# EAGLE design dice (EAGLE 5.07)
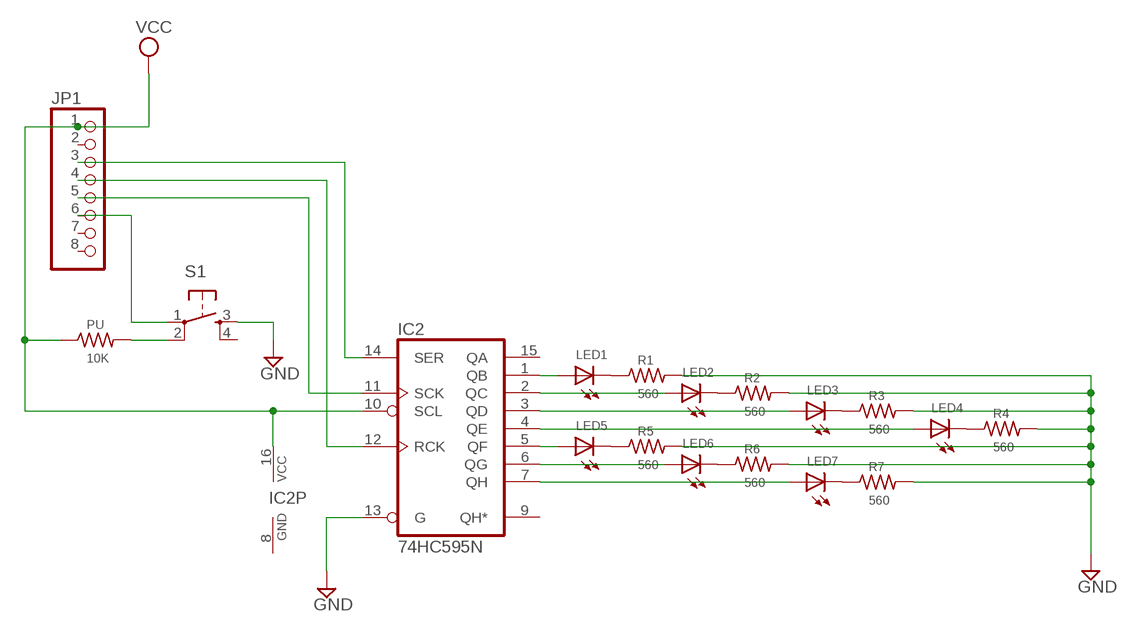
[diagram p0: schematic, sheet 1]

## Parts
IC2  74HC595N  [DIL16]
JP1  PINHD-1X8  [1X08]
LED1  LEDLUMILED  LED5MM  [LED5MM]
LED2  LEDLUMILED  LED5MM  [LED5MM]
LED3  LEDLUMILED  LED5MM  [LED5MM]
LED4  LEDLUMILED  LED5MM  [LED5MM]
LED5  LEDLUMILED  LED5MM  [LED5MM]
LED6  LEDLUMILED  LED5MM  [LED5MM]
LED7  LEDLUMILED  LED5MM  [LED5MM]
PU  10K  R-US_0204/5  [0204/5]
R1  560  R-US_0204/5  [0204/5]
R2  560  R-US_0204/5  [0204/5]
R3  560  R-US_0204/5  [0204/5]
R4  560  R-US_0204/5  [0204/5]
R5  560  R-US_0204/5  [0204/5]
R6  560  R-US_0204/5  [0204/5]
R7  560  R-US_0204/5  [0204/5]
S1  TAC_SWITCHPTH  [TACTILE-PTH]

## Nets
GND: IC2.13(G) R1.2 R2.2 R3.2 R4.2 R5.2 R6.2 R7.2 S1.3
LED1: IC2.1(QB) LED1.A
N$1: LED1.K(C) R1.1
N$2: IC2.14(SER) JP1.3
N$3: IC2.2(QC) LED2.A
N$4: IC2.3(QD) LED3.A
N$5: IC2.4(QE) LED4.A
N$6: IC2.5(QF) LED5.A
N$7: IC2.6(QG) LED6.A
N$8: IC2.7(QH) LED7.A
N$9: LED2.K(C) R2.1
N$10: LED3.K(C) R3.1
N$11: LED4.K(C) R4.1
N$12: LED5.K(C) R5.1
N$13: LED6.K(C) R6.1
N$14: LED7.K(C) R7.1
N$15: IC2.12(RCK) JP1.4
N$16: IC2.11(SCK) JP1.5
N$17: JP1.6 S1.1
N$18: PU.2 S1.2
VCC: IC2.10(SCL) IC2.16(VCC) JP1.1 PU.1
Unconnected: IC2.9(QH*) IC2.15(QA) JP1.2 JP1.7 JP1.8 S1.4

## Power pins joined to a net without a drawn wire
GND: IC2.8(GND)

## Library data of the parts
IC2 = 74xx-eu:74*595: 8-bit SHIFT REGISTER, output latch
JP1 = pinhead:PINHD-1X8: PIN HEADER
LED1-LED7 = led:LED: LED OSRAM: - CHIPLED LG R971, LG N971, LY N971, LG Q971, LY Q971, LO R971, LY R971 LH N974, LH R974 LS Q976, LO Q976, LY Q976 LO Q996 - Hyper CHIPLED LW Q18S LB Q993, LB Q99A, LB R99A - SideLED LS A670, LO A670, LY A670, LG A670, LP A670 LB A673, LV A673, LT A673, LW A673 LH A674 LY A675 LS A676, LA A676, LO A676, LY A676, LW A676 LS A679, LY A679, LG A679 - Hyper Micro SIDELED® LS Y876, LA Y876, LO Y876, LY Y876 LT Y87S - SmartLED LW L88C, LW L88S LB L89C, LB L89S, LG L890 LS L89K, LO L89K, LY L89K LS L896, LA L896, LO L896, LY L896 - TOPLED LS T670, LO T670, LY T670, LG T670, LP T670 LSG T670, LSP T670, LSY T670, LOP T670, LYG T670 LG T671, LOG T671, LSG T671 LB T673, LV T673, LT T673, LW T673 LH T674 LS T676, LA T676, LO T676, LY T676, LB T676, LH T676, LSB T676, LW T676 LB T67C, LV T67C, LT T67C, LS T67K, LO T67K, LY T67K, LW E67C LS E67B, LA E67B, LO E67B, LY E67B, LB E67C, LV E67C, LT E67C LW T67C LS T679, LY T679, LG T679 LS T770, LO T770, LY T770, LG T770, LP T770 LB T773, LV T773, LT T773, LW T773 LH T774 LS E675, LA E675, LY E675, LS T675 LS T776, LA T776, LO T776, LY T776, LB T776 LHGB T686 LT T68C, LB T68C - Hyper Mini TOPLED® LB M676 - Mini TOPLED Santana® LG M470 LS M47K, LO M47K, LY M47K Source: http://www.osram.convergy.de LUXEON: - LUMILED® LXK2-PW12-R00, LXK2-PW12-S00, LXK2-PW14-U00, LXK2-PW14-V00 LXK2-PM12-R00, LXK2-PM12-S00, LXK2-PM14-U00 LXK2-PE12-Q00, LXK2-PE12-R00, LXK2-PE12-S00, LXK2-PE14-T00, LXK2-PE14-U00 LXK2-PB12-K00, LXK2-PB12-L00, LXK2-PB12-M00, LXK2-PB14-N00, LXK2-PB14-P00, LXK2-PB14-Q00 LXK2-PR12-L00, LXK2-PR12-M00, LXK2-PR14-Q00, LXK2-PR14-R00 LXK2-PD12-Q00, LXK2-PD12-R00, LXK2-PD12-S00 LXK2-PH12-R00, LXK2-PH12-S00 LXK2-PL12-P00, LXK2-PL12-Q00, LXK2-PL12-R00 Source: www.luxeon.com KINGBRIGHT: KA-3528ASYC Source: www.kingbright.com
PU R1-R7 = resistor:R-US_: RESISTOR, American symbol
S1 = SparkFun:TAC_SWITCH: Momentary Switch Button commonly used for reset or general input. Spark Fun Electronics SKU : COM-00097

## Board
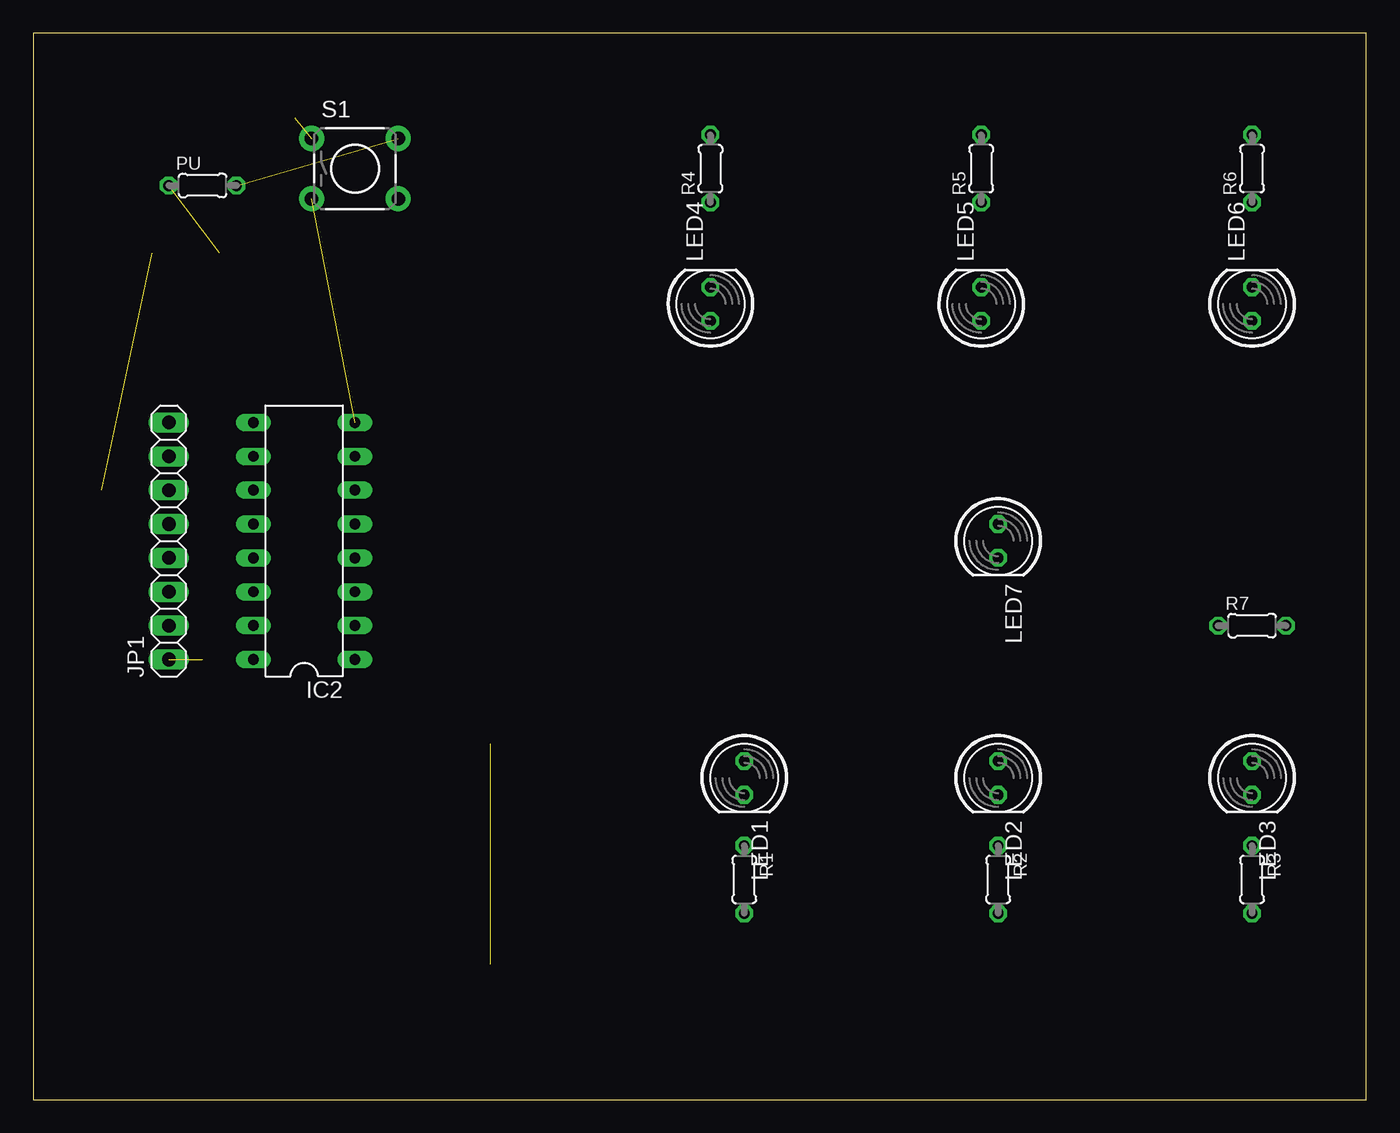
[diagram p1: board, top side]
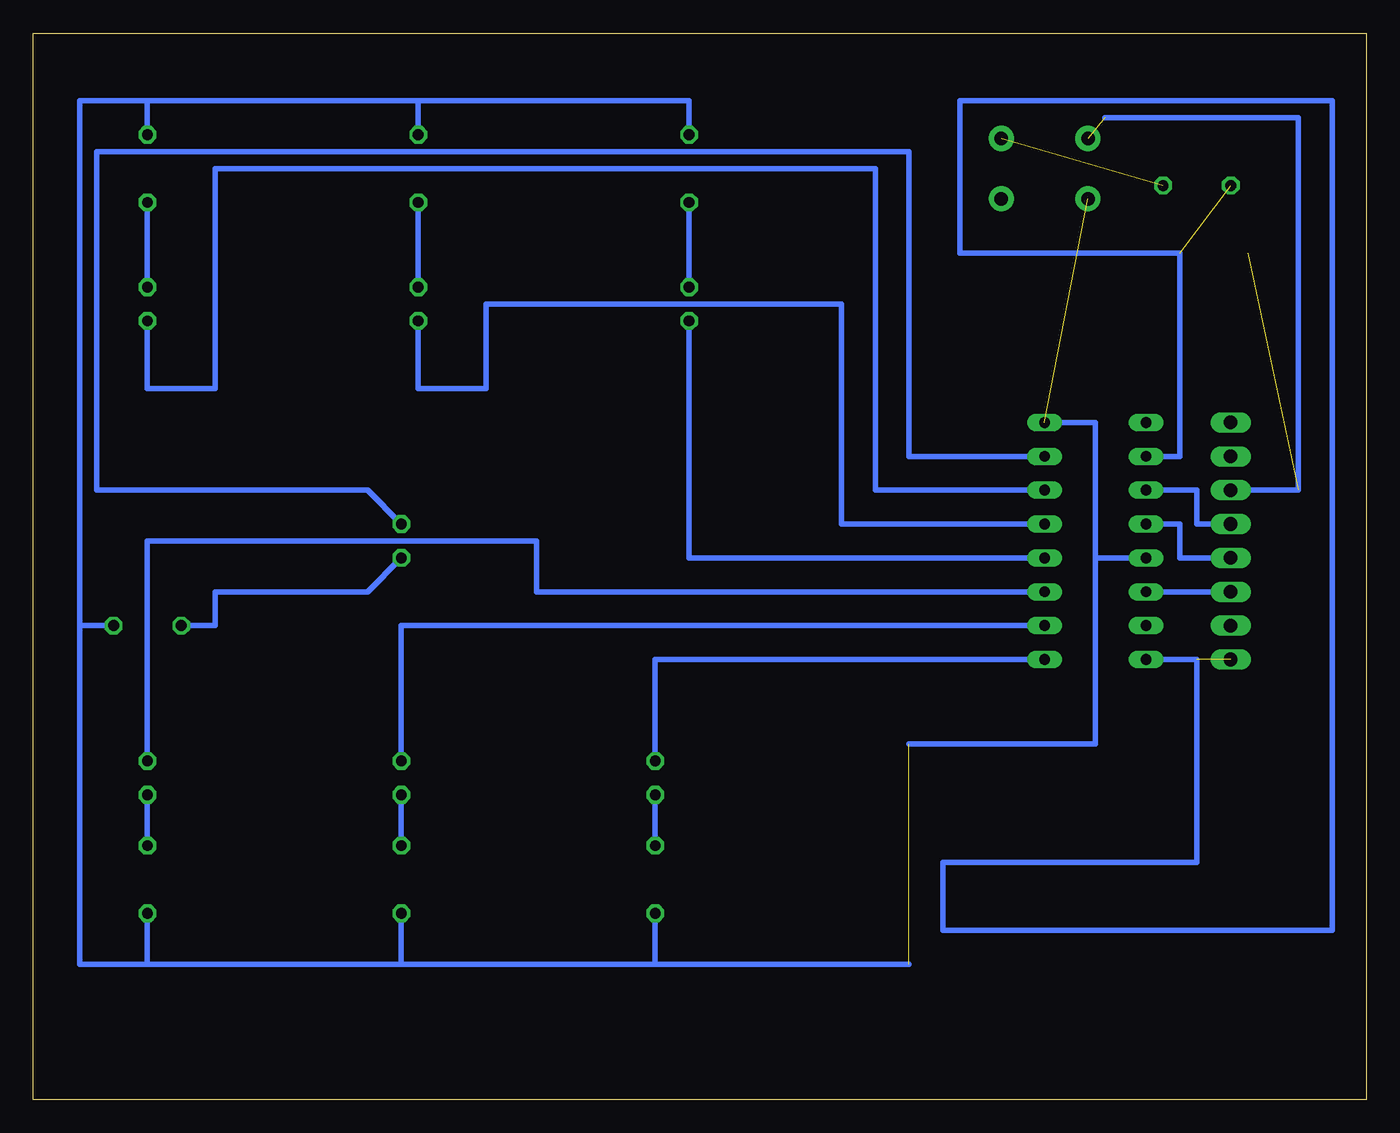
[diagram p2: board, bottom side, seen from below]

Size 100 x 80 mm. Coordinates in mm from the lower left corner, seen from the top.
Outline: 0,0 100,0 100,80 0,80 0,0
Copper layers (1*16): Top 0.035mm / dielectric 1.5mm / Bottom 0.035mm
Design rules "default": minimum track width 10mil, minimum drill 24mil, track to track 8mil, track to pad 8mil, pad to pad 8mil, via to via 8mil, smd to smd 8mil, copper to edge 40mil, drill to drill 8mil, minimum pad ring 10mil, minimum via ring 8mil, stop-mask expansion 4mil, vias tented up to drill 0mil, thermal gap 10mil

### Footprints (pad centres in the part's own frame; a part is rotated, then mirrored left to right if it is on the bottom)
DIL16 = drill 0.813 long: 1 -8.89,-3.81; 2 -6.35,-3.81; 3 -3.81,-3.81; 4 -1.27,-3.81; 5 1.27,-3.81; 6 3.81,-3.81; 7 6.35,-3.81; 8 8.89,-3.81; 9 8.89,3.81; 10 6.35,3.81; 11 3.81,3.81; 12 1.27,3.81; 13 -1.27,3.81; 14 -3.81,3.81; 15 -6.35,3.81; 16 -8.89,3.81
1X08 = drill 1.016 long: 1 -8.89,0; 2 -6.35,0; 3 -3.81,0; 4 -1.27,0; 5 1.27,0; 6 3.81,0; 7 6.35,0; 8 8.89,0
LED5MM = drill 0.813 octagon: A -1.27,0; K 1.27,0
0204/5 = drill 0.813 octagon: 1 -2.54,0; 2 2.54,0
TACTILE-PTH = drill 1.016 pad 1.88 round: 1 -3.251,2.261; 2 3.251,2.261; 3 -3.251,-2.261; 4 3.251,-2.261

### Placement (x,y rotation side)
IC2  20.32,41.91 90 top
JP1  10.16,41.91 90 top
LED1  53.34,24.13 270 top
LED2  72.39,24.13 270 top
LED3  91.44,24.13 270 top
LED4  50.8,59.69 90 top
LED5  71.12,59.69 90 top
LED6  91.44,59.69 90 top
LED7  72.39,41.91 270 top
PU  12.7,68.58 0 top
R1  53.34,16.51 270 top
R2  72.39,16.51 270 top
R3  91.44,16.51 270 top
R4  50.8,69.85 90 top
R5  71.12,69.85 90 top
R6  91.44,69.85 90 top
R7  91.44,35.56 0 top
S1  24.13,69.85 0 top

### Tracks (layer width: path | path; a pad name or v marks a point on that pad's centre or on a via)
GND  (2 unrouted)
  Bottom 0.406: R4.2 50.8,74.93 71.12,74.93 | 71.12,74.93 R5.2 | 91.44,74.93 71.12,74.93 | 96.52,35.56 96.52,74.93 91.44,74.93 | 96.52,35.56 R7.2 | 72.39,10.16 R2.2 | 53.34,10.16 72.39,10.16 | 53.34,10.16 R1.2 | 34.29,10.16 53.34,10.16 | 96.52,35.56 96.52,10.16 91.44,10.16 | 91.44,10.16 R3.2 | 72.39,10.16 91.44,10.16 | 91.44,74.93 R6.2 | 20.32,40.64 IC2.13 | 20.32,40.64 20.32,50.8 IC2.8 | 34.29,26.67 20.32,26.67 20.32,40.64
LED1
  Bottom 0.406: LED1.A 53.34,33.02 IC2.1
N$1
  Bottom 0.406: LED1.K R1.1
N$2
  Bottom 0.406: IC2.14 JP1.3
N$3
  Bottom 0.406: LED2.A 72.39,35.56 25.4,35.56 IC2.2
N$4
  Bottom 0.406: LED3.A 91.44,29.21 91.44,41.91 62.23,41.91 62.23,38.1 IC2.3
N$5
  Bottom 0.406: LED4.A 50.8,40.64 IC2.4
N$6
  Bottom 0.406: LED5.A 71.12,53.34 66.04,53.34 66.04,59.69 39.37,59.69 39.37,58.42 39.37,43.18 IC2.5
N$7
  Bottom 0.406: LED6.A 91.44,53.34 86.36,53.34 86.36,54.61 86.36,69.85 36.83,69.85 36.83,68.58 36.83,45.72 IC2.6
N$8
  Bottom 0.406: LED7.A 74.93,45.72 95.25,45.72 95.25,71.12 34.29,71.12 34.29,66.04 34.29,48.26 IC2.7
N$9
  Bottom 0.406: LED2.K R2.1
N$10
  Bottom 0.406: LED3.K R3.1
N$11
  Bottom 0.406: R4.1 LED4.K
N$12
  Bottom 0.406: R5.1 LED5.K
N$13
  Bottom 0.406: R6.1 LED6.K
N$14
  Bottom 0.406: LED7.K 74.93,38.1 86.36,38.1 86.36,35.56 R7.1
N$15
  Bottom 0.406: IC2.12 13.97,43.18 13.97,40.64 JP1.4
N$16
  Bottom 0.406: IC2.11 12.7,45.72 12.7,44.45 12.7,43.18 JP1.5
N$17  (2 unrouted)
  Bottom 0.406: JP1.6 5.08,45.72 5.08,73.66 19.61,73.66
N$18  (1 unrouted)
VCC  (2 unrouted)
  Bottom 0.406: IC2.10 13.97,48.26 13.97,63.5 30.48,63.5 30.48,74.93 2.54,74.93 2.54,12.7 31.75,12.7 31.75,17.78 12.7,17.78 12.7,33.02 IC2.16